# EAGLE design MPPT (EAGLE 7.5.0)
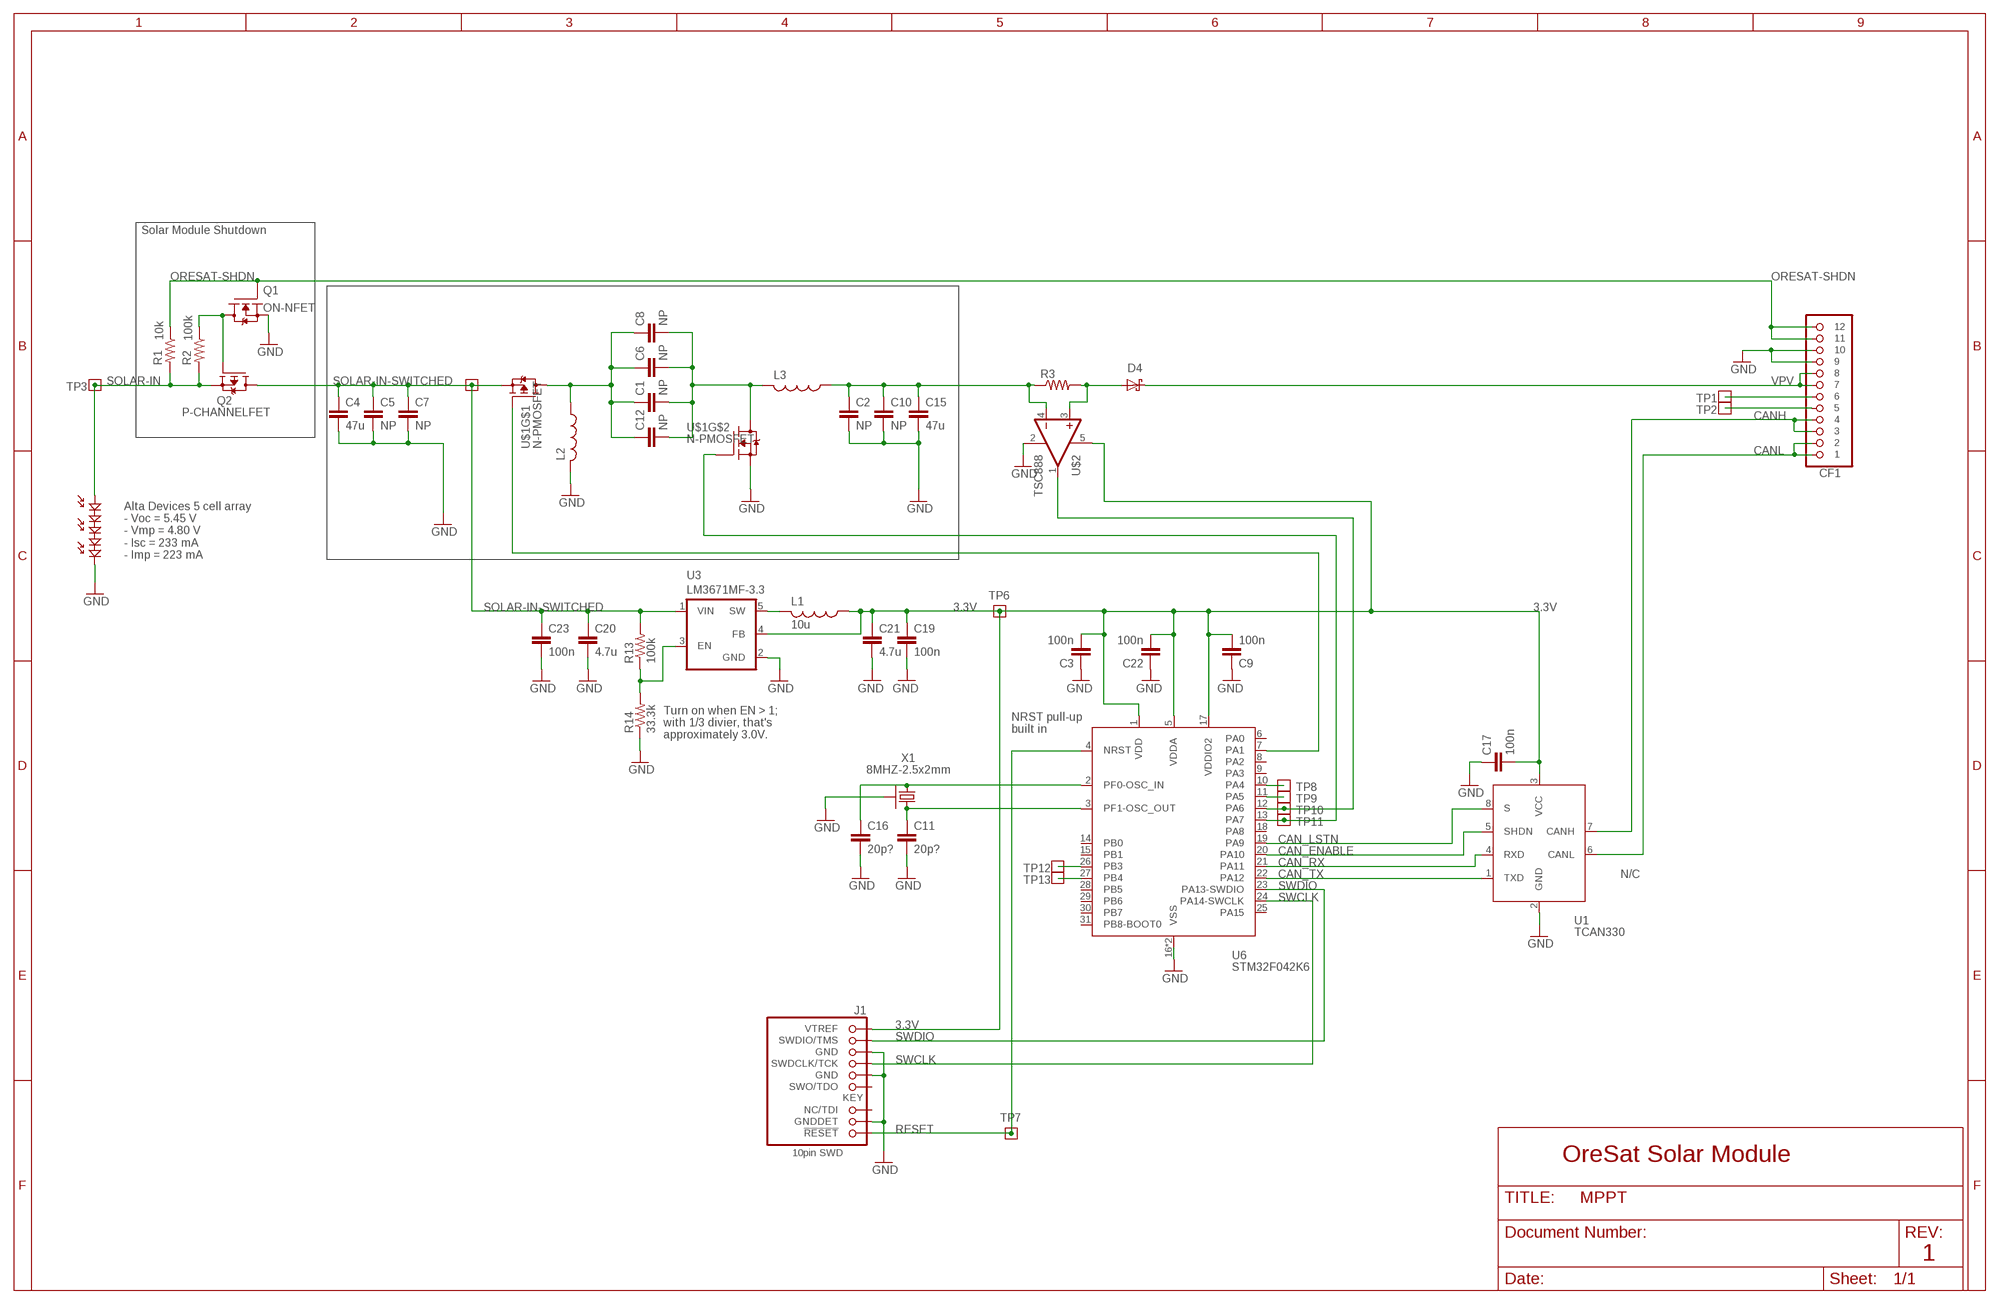
[diagram p0: schematic, sheet 1]

## Parts
C1  NP  C-EUC0603  [C0603]
C2  NP  C-EUC0603  [C0603]
C3  100n  C-EU0402-B-NOSILK  [.0402-B-NOSILK]
C4  47u  C-EUC0603  [C0603]
C5  NP  C-EUC0603  [C0603]
C6  NP  C-EUC0603  [C0603]
C7  NP  C-EUC0603  [C0603]
C8  NP  C-EUC0603  [C0603]
C9  100n  C-EU0402-B-NOSILK  [.0402-B-NOSILK]
C10  NP  C-EUC0603  [C0603]
C11  20p?  C-EU0402-B-NOSILK  [.0402-B-NOSILK]
C12  NP  C-EUC0603  [C0603]
C15  47u  C-EUC0603  [C0603]
C16  20p?  C-EU0402-B-NOSILK  [.0402-B-NOSILK]
C17  100n  C-EU0402-B-NOSILK  [.0402-B-NOSILK]
C19  100n  C-EU0402-B-NOSILK  [.0402-B-NOSILK]
C20  4.7u  C-EUC0603  [C0603]
C21  4.7u  C-EUC0603  [C0603]
C22  100n  C-EU0402-B-NOSILK  [.0402-B-NOSILK]
C23  100n  C-EU0402-B-NOSILK  [.0402-B-NOSILK]
CF1  ORESAT-SOLARPANEL-12PIN  [CON-1.27-F-HARTING-1522012X601XXX]
D2  ALTA-5-CELL-ARRAY  [ALTA-FIVE-CELL]
D4  SOD123-B SCHOTTKY  DIODE_SCHOTTKY-SOD123-B  [SOD123-B]
J1  1.27MM-SWD-CONNECTOR  [1.27MM_2X5]
L1  10u  L-USL2012C  [L2012C]
L2  L-USL1812  [L1812]
L3  L-USL1812  [L1812]
Q1  ON-NFET  ON-N-CHANNEL-FET  [SOT23]
Q2  P-CHANNELFET  [SO8]
R1  10k  R-US_0402-B-NOSILK  [.0402-B-NOSILK]
R2  100k  R-US_0402-B-NOSILK  [.0402-B-NOSILK]
R3  R-US_R0603  [R0603]
R13  100k  R-US_0402-B-NOSILK  [.0402-B-NOSILK]
R14  33.3k  R-US_0402-B-NOSILK  [.0402-B-NOSILK]
TP1  TEST-POINT  [2MM-TEST-POINT]
TP2  TEST-POINT  [2MM-TEST-POINT]
TP3  TEST-POINT  [2MM-TEST-POINT]
TP4  TEST-POINT  [2MM-TEST-POINT]
TP6  TEST-POINT  [2MM-TEST-POINT]
TP7  TEST-POINT  [2MM-TEST-POINT]
TP8  TEST-POINT  [2MM-TEST-POINT]
TP9  TEST-POINT  [2MM-TEST-POINT]
TP10  TEST-POINT  [2MM-TEST-POINT]
TP11  TEST-POINT  [2MM-TEST-POINT]
TP12  TEST-POINT  [2MM-TEST-POINT]
TP13  TEST-POINT  [2MM-TEST-POINT]
U1  TCAN330  [SOT23-8_TI-DCN]
U3  LM3671MF-3.3  LM3761  [SOT23-5]
U6  STM32F042K6  [QFP32-7X7]
U$1  N-PMOSFET  [5X6POWERFLAT]
U$2  TSC888  [SOT23-5]
X1  8MHZ-2.5x2mm  CRYSTAL-WITH-GND  [CRYSTAL_2.5X2]

## Nets
3.3V: C3.2 C9.2 C17.2 C19.1 C21.1 C22.2 J1.VTREF L1.1 TP6.1 U1.3(VCC) U3.4(FB) U6.1(VDD) U6.5(VDDA) U6.17(VDDIO2) U$2.5(V+)
CAN_ENABLE: U1.5(SHDN) U6.20(PA10)
CAN_LSTN: U1.8(S) U6.19(PA9)
CAN_RX: U1.4(RXD) U6.21(PA11)
CAN_TX: U1.1(TXD) U6.22(PA12)
CANH: CF1.3 CF1.4 U1.7(CANH)
CANL: CF1.1 CF1.2 U1.6(CANL)
CRYSTALIN: C16.1 U6.2(PF0-OSC_IN) X1.1
CRYSTALOUT: C11.1 U6.3(PF1-OSC_OUT) X1.3
GND: C2.2 C3.1 C4.2 C5.2 C7.2 C9.1 C10.2 C11.2 C15.2 C16.2 C17.1 C19.2 C20.2 C21.2 C22.1 C23.2 CF1.9 CF1.10 D2.NEG J1.GND J1.GND@2(GND) J1.GNDDET L2.2 Q1.2(S) R14.1 U1.2(GND) U3.2(GND) U6.16(VSS) U6.32(VSS) U$1.S2(S) U$2.2(GND) X1.2(SHIELD) X1.4(SHIELD)
N6: Q1.3(D) Q2.4(G) R2.1
N$1: C1.1 C6.1 C8.1 C12.1 L2.1 U$1.D1(D) U$1.D11(D) U$1.D12(D) U$1.D13(D) U$1.D14(D)
N$2: C1.2 C6.2 C8.2 C12.2 L3.2 U$1.D2(D) U$1.D21(D) U$1.D22(D) U$1.D23(D) U$1.D24(D)
N$3: CF1.6 TP1.1
N$4: CF1.5 TP2.1
N$5: TP8.1 U6.10(PA4)
N$6: TP9.1 U6.11(PA5)
N$7: TP10.1 U6.12(PA6) U$2.1(OUT)
N$8: TP11.1 U6.13(PA7) U$1.G2(G)
N$9: TP12.1 U6.26(PB3)
N$10: TP13.1 U6.27(PB4)
N$11: C2.1 C10.1 C15.1 L3.1 R3.1 U$2.4(-IN)
N$12: U6.7(PA1) U$1.G1(G)
N$14: D4.A(ANODE) R3.2 U$2.3(+IN)
ORESAT-SHDN: CF1.11 CF1.12 Q1.1(G) R1.1
RESET: J1.!RESET TP7.1 U6.4(NRST)
SOLAR-IN: D2.POS Q2.1(S) Q2.2(S) Q2.3(S) R1.2 R2.2 TP3.1
SOLAR-IN-SWITCHED: C4.1 C5.1 C7.1 C20.1 C23.1 Q2.5(D) Q2.6(D) Q2.7(D) Q2.8(D) R13.2 TP4.1 U3.1(VIN) U$1.S1(S)
STEPD: L1.2 U3.5(SW)
SWCLK: J1.SWDCLK(SWDCLK/TCK) U6.24(PA14-SWCLK)
SWDIO: J1.SWDIO(SWDIO/TMS) U6.23(PA13-SWDIO)
VDIV: R13.1 R14.2 U3.3(EN)
VPV: CF1.7 CF1.8 D4.K(CATHODE)
Unconnected: J1.NC(NC/TDI) J1.SWO(SWO/TDO) U6.6(PA0) U6.8(PA2) U6.9(PA3) U6.14(PB0) U6.15(PB1) U6.18(PA8) U6.25(PA15) U6.28(PB5) U6.29(PB6) U6.30(PB7) U6.31(PB8-BOOT0)

## Notes on the sheet
- Solar Module Shutdown
- Alta Devices 5 cell array
  - Voc = 5.45 V
  - Vmp = 4.80 V
  - Isc = 233 mA
  - Imp = 223 mA
- NRST pull-up
  built in
- Turn on when EN > 1; 
  with 1/3 divier, that's
  approximately 3.0V.
- N/C
- OreSat Solar Module
- 1

## Library data of the parts
C1-C12 C15-C17 C19 C22 C23 = rcl_custom:C-EU: CAPACITOR, European symbol
C20 C21 = rcl:C-EU: CAPACITOR, European symbol
CF1 = oresat-eagle:ORESAT-SOLARPANEL-12PIN
D2 = alta-cell:ALTA-5-CELL-ARRAY
D4 = apdm:DIODE_SCHOTTKY: Schottky Diode Generic
J1 = con-swd:1.27MM-SWD-CONNECTOR
L1-L3 = rcl:L-US: INDUCTOR, American symbol
Q1 = on-n-channel-fet:ON-N-CHANNEL-FET
Q2 = vishay-p-channel-fet:P-CHANNELFET
R1 R2 R13 R14 = rcl_custom:R-US_: RESISTOR, American symbol
R3 = rcl:R-US_: RESISTOR, American symbol
TP1-TP4 TP6-TP13 = Tova:TEST-POINT
U1 = TCAN330:TCAN330
U3 = LM3761:LM3761: http://www.digikey.com/product-detail/en/texas-instruments/LM3671MF-3.3-NOPB/LM3671MF-3.3-NOPBCT-ND/1590190
U6 = STM32F042K:STM32F042K6
U$1 = N-PMosfet:N-PMOSFET: http://www.digikey.com/product-detail/en/stmicroelectronics/STL40C30H3LL/497-15314-1-ND/5170833
U$2 = TSC888:TSC888: http://www.st.com/en/amplifiers-and-comparators/tsc888.html
X1 = low-gain-radio:CRYSTAL-WITH-GND

## Board
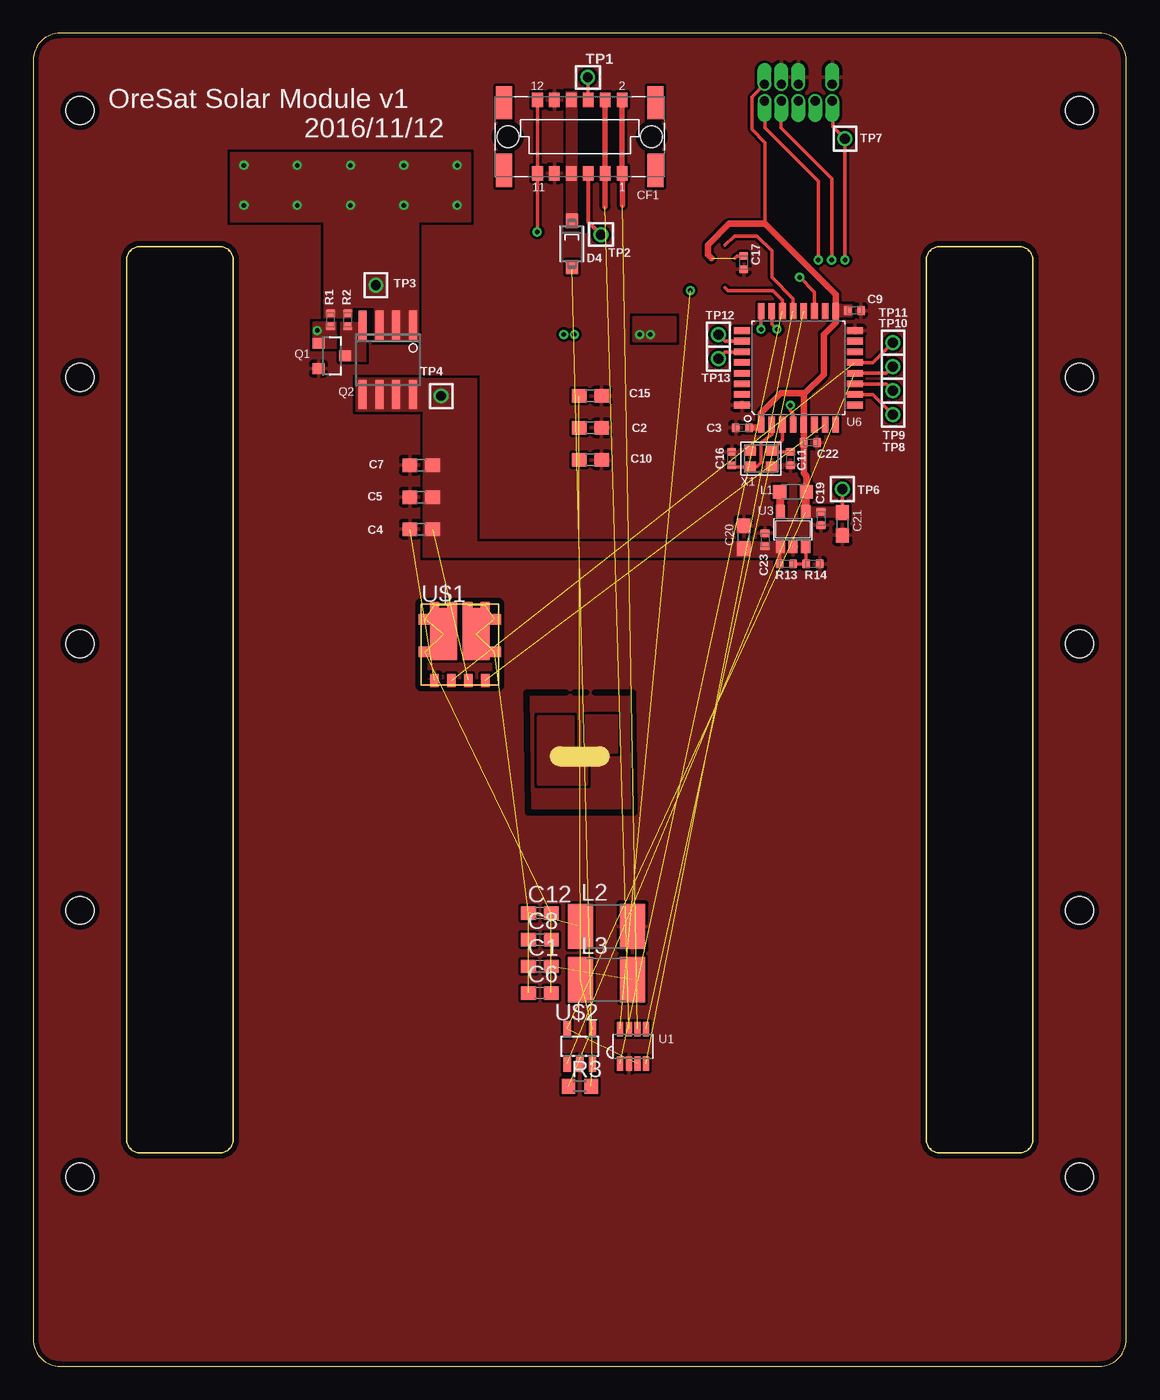
[diagram p1: board, top side]
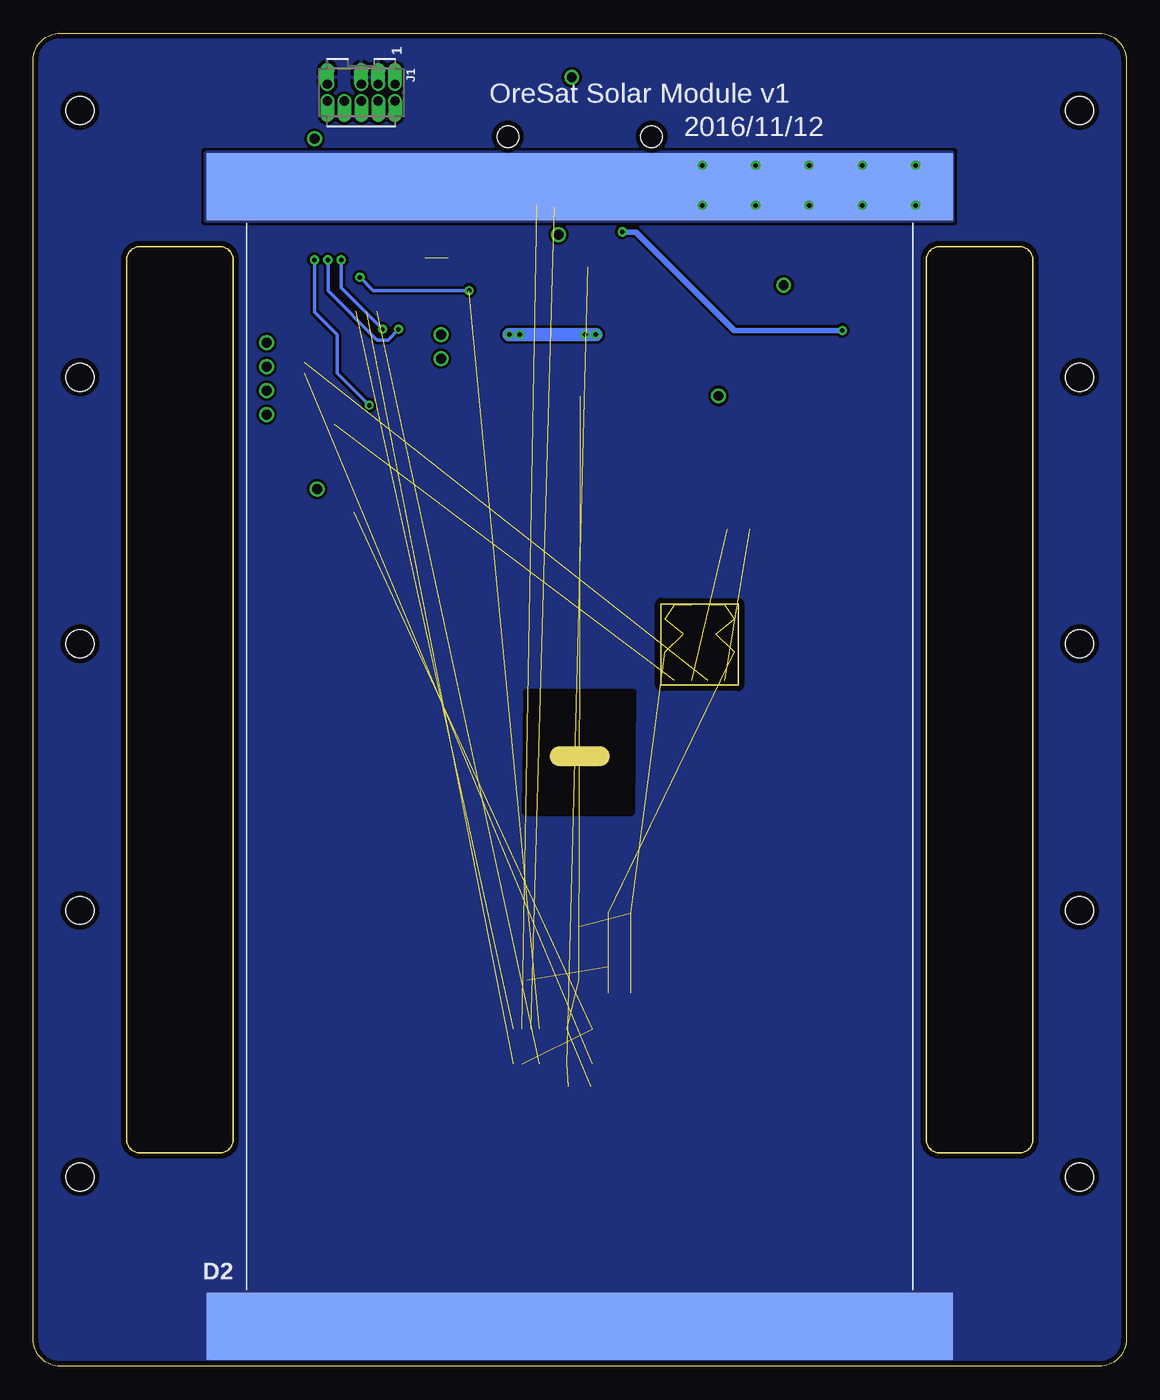
[diagram p2: board, bottom side, seen from below]

Size 82 x 100 mm. Coordinates in mm from the lower left corner, seen from the top.
Outline: 80,100 2,100 arc90 0,98 0,2 arc90 2,0 80,0 arc90 82,2 82,98 arc90 80,100
Outline: 15,83 15,17 arc-90 14,16 8,16 arc-90 7,17 7,83 arc-90 8,84 14,84 arc-90 15,83
Outline: 67,17 67,83 arc-90 68,84 74,84 arc-90 75,83 75,17 arc-90 74,16 68,16 arc-90 67,17
Copper layers (1*16): Top 0.0356mm / dielectric 1.5011mm / Bottom 0.0356mm
Design rules "OSH-Park-2-layer *": minimum track width 6mil, minimum drill 13mil, track to track 6mil, track to pad 6mil, pad to pad 6mil, via to via 6mil, smd to smd 6mil, copper to edge 15mil, drill to drill 6mil, minimum pad ring 7mil, minimum via ring 7mil, stop-mask expansion 3mil, vias tented up to drill 13mil, thermal gap 10mil
Holes 2.1 mm at 3.5,14.2 3.5,34.2 3.5,54.2 3.5,74.2 3.5,94.2 78.5,14.2 78.5,34.2 78.5,54.2 78.5,74.2 78.5,94.2
tRestrict: 7 lines
bRestrict: 4 lines
Milling: 1 lines

### Footprints (pad centres in the part's own frame; a part is rotated, then mirrored left to right if it is on the bottom)
C0603 = smd 1.1 x 1: 1 -0.85,0; 2 0.85,0
.0402-B-NOSILK = smd 0.6 x 0.7: 1 -0.5,0; 2 0.5,0
CON-1.27-F-HARTING-1522012X601XXX = smd 0.8 x 1.1: 1 3.175,-2.75; 2 3.175,2.75; 3 1.905,-2.75; 4 1.905,2.75; 5 0.635,-2.75; 6 0.635,2.75; 7 -0.635,-2.75; 8 -0.635,2.75; 9 -1.905,-2.75; 10 -1.905,2.75; 11 -3.175,-2.75; 12 -3.175,2.75 | smd 1.2 x 2.5: P$1 -5.685,-2.55; P$2 -5.685,2.55; P$3 5.685,2.55; P$4 5.685,-2.55 | hole 1.6: -5.385,0; 5.385,0
ALTA-FIVE-CELL = smd 56 x 5: NEG 0,42.75; POS 0,-42.75
SOD123-B = smd 1.05 x 0.9: A 1.725,0; K -1.725,0
1.27MM_2X5 = drill 0.7 pad 1.016 offset: !RESET 0.635,-2.54; GND -0.635,1.27; GND@2 -0.635,0; GNDDET -0.635,-2.54; NC 0.635,-1.27; SWDCLK 0.635,1.27; SWDIO 0.635,2.54; SWO 0.635,0; VTREF -0.635,2.54
L2012C = smd 1 x 1: 1 -1,0; 2 1,0
L1812 = smd 1.9 x 3.4: 1 -1.95,0; 2 1.95,0
SOT23 = smd 0.8 x 0.9: 1 -0.95,-1; 2 0.95,-1; 3 0,1
SO8 = smd 0.6 x 2.2: 1 -1.905,-2.6; 2 -0.635,-2.6; 3 0.635,-2.6; 4 1.905,-2.6; 5 1.905,2.6; 6 0.635,2.6; 7 -0.635,2.6; 8 -1.905,2.6
R0603 = smd 1 x 1.1: 1 -0.85,0; 2 0.85,0
2MM-TEST-POINT = drill 0.737: 1 0,0
SOT23-8_TI-DCN = smd 0.45 x 1.1: 1 -0.975,-1.3; 2 -0.325,-1.3; 3 0.325,-1.3; 4 0.975,-1.3; 5 0.975,1.3; 6 0.325,1.3; 7 -0.325,1.3; 8 -0.975,1.3
SOT23-5 = smd 0.69 x 0.99: 1 -0.95,-1.29; 2 0,-1.29; 3 0.95,-1.29; 4 0.95,1.3; 5 -0.95,1.3
QFP32-7X7 = smd 1.2 x 0.5: 1 -4.25,2.8; 2 -4.25,2; 3 -4.25,1.2; 4 -4.25,0.4; 5 -4.25,-0.4; 6 -4.25,-1.2; 7 -4.25,-2; 8 -4.25,-2.8; 17 4.25,-2.8; 18 4.25,-2; 19 4.25,-1.2; 20 4.25,-0.4; 21 4.25,0.4; 22 4.25,1.2; 23 4.25,2; 24 4.25,2.8 | smd 0.5 x 1.2: 9 -2.8,-4.25; 10 -2,-4.25; 11 -1.2,-4.25; 12 -0.4,-4.25; 13 0.4,-4.25; 14 1.2,-4.25; 15 2,-4.25; 16 2.8,-4.25; 25 2.8,4.25; 26 2,4.25; 27 1.2,4.25; 28 0.4,4.25; 29 -0.4,4.25; 30 -1.2,4.25; 31 -2,4.25; 32 -2.8,4.25
5X6POWERFLAT = smd 2.025 x 3.9: D1 1.21,1.95; D2 -1.21,1.95 | smd 0.75 x 0.45: D11 0.572,4.125; D24 -0.572,4.125 | smd 0.65 x 0.45: D12 1.898,4.125; D23 -1.898,4.125 | smd 1 x 0.8: D13 2.6,3.04; D14 2.6,0.59; D21 -2.6,0.59; D22 -2.6,3.04 | smd 0.65 x 1: G1 1.905,-1.55; G2 -0.635,-1.55; S1 0.635,-1.55; S2 -1.905,-1.55
SOT23-5' = smd 0.55 x 1.2: 1 -0.95,-1.3; 2 0,-1.3; 3 0.95,-1.3; 4 0.95,1.3; 5 -0.95,1.3
CRYSTAL_2.5X2 = smd 0.9 x 0.8: 1 -0.825,-0.625; 2 0.825,-0.625; 3 0.825,0.625; 4 -0.825,0.625

### Placement (x,y rotation side)
C1  38,30 0 top
C2  41.8,70.4 0 top
C3  53.2,70.4 0 top
C4  29.1,62.8 180 top
C5  29.1,65.2 180 top
C6  38,28 0 top
C7  29.1,67.6 180 top
C8  38,32 0 top
C9  61.6,79.2 180 top
C10  41.8,68 0 top
C11  56.8,68.1 270 top
C12  38,34 0 top
C15  41.8,72.8 0 top
C16  52.4,68.1 90 top
C17  53.3,82.8 90 top
C19  59.1,63.6 270 top
C20  53.3,62.2 90 top
C21  60.7,63.2 270 top
C22  58.3,69.3 180 top
C23  54.9,62 90 top
CF1  41,92.25 0 top
D2  41,45.75 180 bottom
D4  40.4,84.2 270 top
J1  57.4,95.55 270 bottom
L1  57,65.6 180 top
L2  43,33 0 top
L3  43,29 0 top
Q1  22.4,75.8 270 top
Q2  26.6,75.5 180 top
R1  22.3,78.5 90 top
R2  23.6,78.5 90 top
R3  41,21 0 top
R13  56.5,60.2 180 top
R14  58.5,60.2 180 top
TP1  41.6,96.7 90 top
TP2  42.6,84.9 90 top
TP3  25.7,81.1 0 top
TP4  30.6,72.8 0 top
TP6  60.7,65.8 0 top
TP7  60.9,92.1 0 top
TP8  64.5,71.4 0 top
TP9  64.5,73.2 0 top
TP10  64.5,75 0 top
TP11  64.5,76.8 0 top
TP12  51.4,77.4 0 top
TP13  51.4,75.6 0 top
U1  45,24 0 top
U3  57,62.8 0 top
U6  57.4,74.9 90 top
U$1  32,53 0 top
U$2  TSC888  [SOT23-5']  41,24 0 top
X1  54.6,68.1 0 top

### Tracks (layer width: path | path; a pad name or v marks a point on that pad's centre or on a via)
3.3V  (3 unrouted)
  Top 0.25: 54.9,85.7 54.9,91.8 53.9,92.8 53.9,95.22 J1.VTREF | TP6.1 C21.1
  Top 0.254: 52.62,83.12 52.8,83.3 C17.2
  Top 0.5: 50.88,83.12 50.6,83.4 50.6,84.1 52.2,85.7 54.9,85.7 60.2,80.4 U6.17 60.2,78.3 59.3,77.4 59.3,74.4 57.9,73 57.8,73 | 57.8,73 56.1,73 54.6,71.5 U6.1 54.6,70.4 C3.2 | 57.8,73 U6.5 C22.2 57.8,67 58,66.8 L1.1
  Top 0.6: U3.4 57.95,65.45 L1.1
  pour Top (isolate 0.25, no thermals): 61.05,63.7 57.7,63.7 57.7,64.45 61.05,64.45
  pour Top (no thermals): 60.1,79.6 60.1,78.8 61.4,78.8 61.4,79.6
CAN_ENABLE  (1 unrouted)
CAN_LSTN  (via drill 0.33)  (1 unrouted)
  Top 0.25: v57.5,81.7 58.6,80.6 U6.19
  Bottom 0.25: v57.5,81.7 56.5,80.7 v49.3,80.7
CAN_RX  (1 unrouted)
  Top 0.25: 51.9,84.1 52.6,84.8 54.3,84.8 55.4,83.7 55.4,81.7 57,80.1 U6.21
CAN_TX  (1 unrouted)
  Top 0.25: 51.9,80.9 52.1,80.7 55.5,80.7 56.2,80 U6.22
CANH  (1 unrouted)
  Top 0.406: 42.9,87 CF1.3 CF1.4
CANL  (1 unrouted)
  Top 0.406: 44.2,87.1 44.2,89.47 CF1.1 CF1.2
CRYSTALIN
  Top 0.25: C16.1 52.52,67.47 X1.1 53.8,67.5 54.3,67.5 54.6,67.8 54.6,69.3 55.4,69.9 U6.2
CRYSTALOUT
  Top 0.25: U6.3 56.2,69.5 X1.3 55.55,68.6 C11.1
GND  (1 unrouted)
  pour Bottom (isolate 0.2, rank 6): 0,0 0,100 82,100 82,0
  pour Top (isolate 0.2, rank 6): 0,0 0,100 82,100 82,0
  pour Bottom (isolate 0.2, no thermals): 12.6,6.2 69.6,6.2 69.6,0 12.3,0 12.3,6.2
N6
  pour Top (isolate 0.2, no thermals): 23.1,75.4 23.1,78.3 24.9,78.3 24.9,75.4
N$1  (9 unrouted)
N$2  (9 unrouted)
N$3
  Top 0.25: CF1.6 41.63,96.67 TP1.1
N$4
  Top 0.3: CF1.5 41.63,85.86 TP2.1
N$5
  Top 0.25: U6.10 63,72.9 TP8.1
N$6
  Top 0.25: U6.11 64,73.7 TP9.1
N$7  (1 unrouted)
  Top 0.25: U6.12 64,74.5 TP10.1
N$8  (1 unrouted)
  Top 0.25: U6.13 63,75.3 TP11.1
N$9
  Top 0.25: U6.26 51.9,76.9 TP12.1
N$10
  Top 0.25: U6.27 51.9,76.1 TP13.1
N$11  (5 unrouted)
N$12  (1 unrouted)
N$14  (2 unrouted)
ORESAT-SHDN  (via drill 0.33)
  Top 0.25: CF1.12 CF1.11 37.83,85.17 v37.8,85.1
  Bottom 0.406: v21.3,77.7 29.4,77.7 36.8,85.1 v37.8,85.1
  pour Top (isolate 0.2, no thermals): 21,76.4 22.7,76.4 22.7,78.3 21,78.3
RESET  (via drill 0.33)
  Top 0.25: U6.4 57,71.5 56.8,71.7 v56.8,72.1 | v60.9,83 TP7.1 60,93 60,94.86 J1.!RESET
  Bottom 0.25: v60.9,83 60.9,79.1 59.2,77.4 59.2,74.5 v56.8,72.1
SOLAR-IN  (via drill 0.33)
  other vias: 15.8,90.1 15.8,87.1 19.8,90.1 19.8,87.1 23.8,87.1 23.8,90.1 27.8,90.1 27.8,87.1 31.8,90.1 31.8,87.1
  pour Top (isolate 0.2, no thermals): 14.8,91 14.8,85.9 21.8,85.9 21.8,78.7 23.9,78.7 23.9,79.5 25.6,79.5 25.6,76.9 28.9,76.9 28.9,85.9 32.8,85.9 32.8,91
  pour Bottom (no thermals): 13.1,91 13.1,86 69,86 69,91
SOLAR-IN-SWITCHED  (1 unrouted)
  Top 0.25: R13.2 56,61.46
  Top 0.5: 56,61.46 U3.1
  pour Top (isolate 0.2, no thermals): 29.3,60.7 29.3,74.1 33.2,74.1 33.2,60.7
  pour Top (isolate 0.2, no thermals): 56.35,60.7 33,60.7 33,61.85 56.35,61.85
  pour Top (isolate 0.2, no thermals): 29.3,74.1 24.2,74.1 24.2,71.7 29.3,71.7
SOLAR-IN-SWITCHED2  (via drill 0.33)
  Bottom 1: v39.8,77.4 v40.6,77.4 v45.5,77.4 v46.3,77.4
  pour Top (isolate 0.2, no thermals): 45,76.9 48.2,76.9 48.2,78.7 45,78.7
STEPD
  Top 0.6: U3.5 56.05,65.45 L1.2
SWCLK  (via drill 0.33)
  Top 0.25: U6.24 v54.6,77.8 | v59.9,83 59.9,89.1 56.1,92.9 56.1,94.89 J1.SWDCLK
  Bottom 0.25: v54.6,77.8 55.4,77 56.2,77 59.9,80.7 v59.9,83
SWDIO  (via drill 0.33)
  Top 0.25: U6.23 55.4,78.2 v55.8,77.8 | v58.9,83 58.9,88.9 54.9,92.9 54.9,94.88 J1.SWDIO
  Bottom 0.25: v55.8,77.8 58.9,80.9 v58.9,83
V3
  pour Top (no thermals): 41.5,43.7 41.5,45.25 40.5,45.25 40.5,48.7 37.9,48.7 37.9,43.7
V4
  pour Top (no thermals): 41.5,48.8 41.5,46.1 43.75,46.1 43.75,48.8
VDIV
  Top 0.25: U3.3 57.95,60.2 R14.2 R13.1
VPV
  pour Top (isolate 0.2, no thermals): 40,85.4 40.8,85.4 40.8,95.6 40,95.6

### Text on the board
tPlace: OreSat Solar Module v1 | 2016/11/12
bPlace: OreSat Solar Module v1 | 2016/11/12